# Altium schematic sheet DebouncedButtons.SchDoc
size A; SheetNumber: 6; SheetTotal: 8
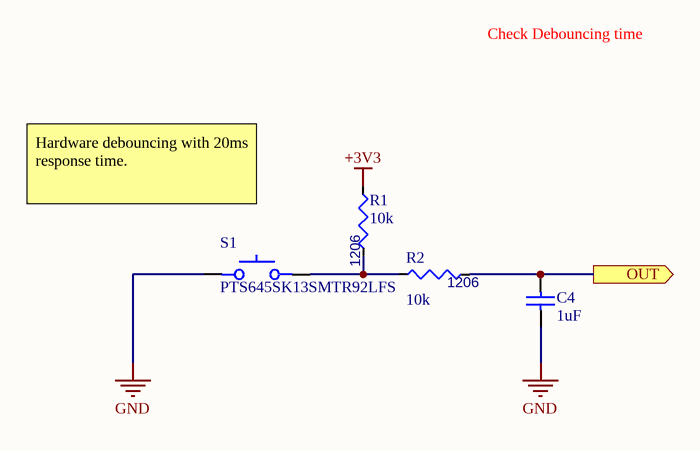
[diagram p0: DebouncedButtons.SchDoc]

## Parts
C4  1uF  [C1206]
R1  10k  [R1206]
R2  10k  [R1206]
S1  PTS645SK13SMTR92LFS  [PTS645SK13SMTR92LFS-Footprint-1]

## Ports
OUT (out)

## Nets
+3V3: R1.2
GND: C4.1 S1.2
OUT: C4.2 R2.1 ; port OUT
NetR1_1: R1.1 R2.2 S1.1

## Notes on the sheet
- Check Debouncing time
- Hardware debouncing with 20ms response time.
- (in symbol CMP-024-000034-3) 1206

## Library data of the parts
C4 = CMP-054-000013-3: CER 1UF 50V X7R 1206; Made by: Brennan Swanton; Reviewed by: Carter Allen; Supplier Part Number 1: 399-C1206C105K5RAC7800CT-ND; Source: Capacitors.SchLib; Design Item ID: CL31B105KBHNNNE; Supplier 1: Digi-Key
R1 R2 = CMP-024-000034-3: 10K OHM 1% 1/4W 1206; Made By: Brennan Swanton; Reviewed By: Carter Allen; Supplier 1: Digi-Key; Supplier Part Number 1: 541-2247-1-ND; Source: Resistors.SchLib; Design Item ID: ERJ-8ENF1002V
S1 = CMP-00027-00000-6: SWITCH TACTILE SPST-NO 0.05A 12V; Manufacturer: Digi-Key; Made By: Victor; Supplier Part Number: CKN10817CT-ND; Design Item ID: PTS645SK13SMTR92LFS